# Altium schematic sheet Revision History.SchDoc: Revision History
size 431 x 279 mm; DrawnBy: DD; DocumentNumber: GHL-1-21002; Revision: C; SheetNumber: 7; SheetTotal: 7; ProjectID: 263-03
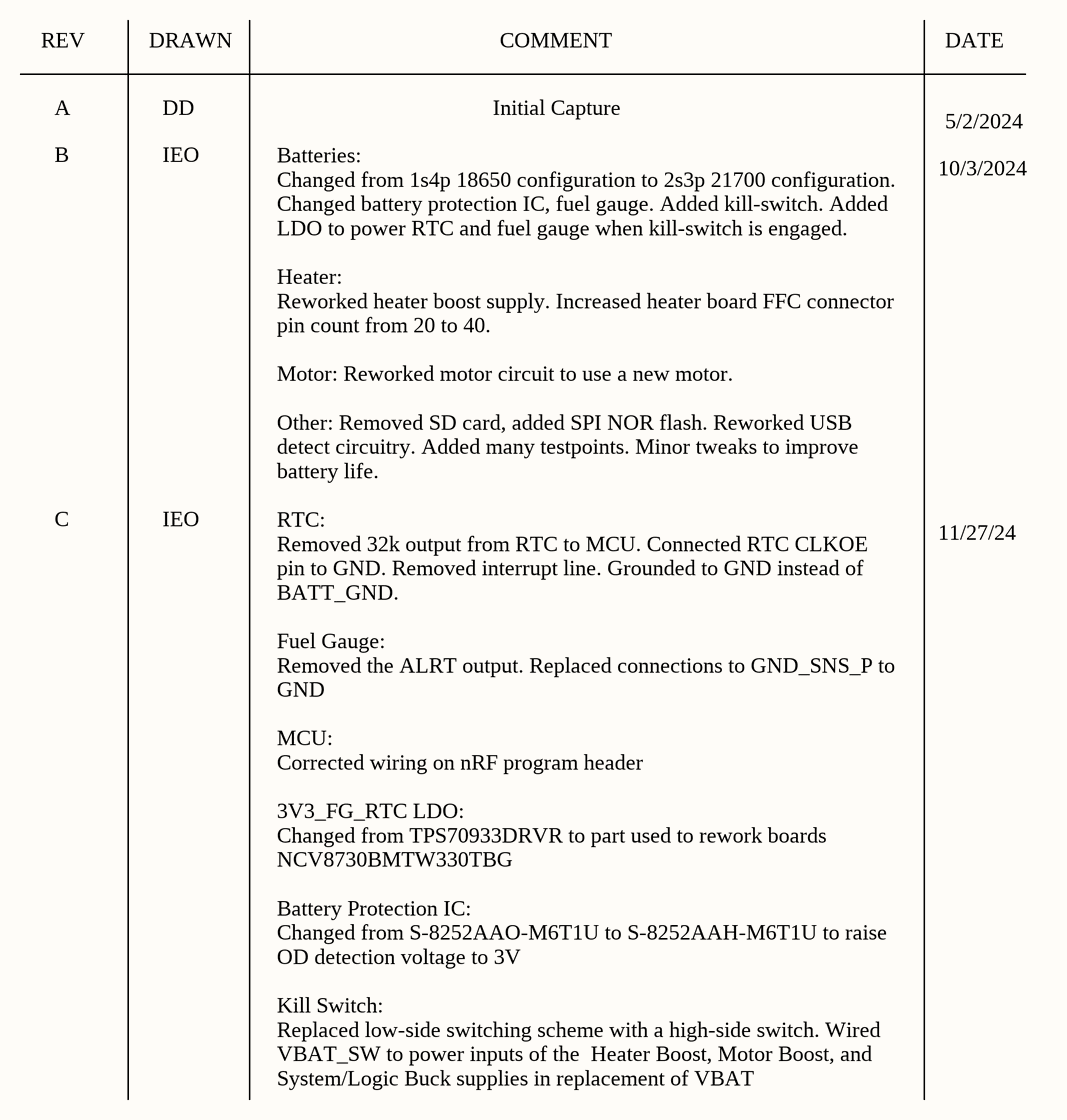
[diagram p0: Revision History.SchDoc]

## Notes on the sheet
- REV
- DRAWN
- COMMENT
- DATE
- A
- B
- DD
- IEO
- Initial Capture
- 10/3/2024
- 5/2/2024
- Batteries:
  Changed from 1s4p 18650 configuration to 2s3p 21700 configuration. Changed battery protection IC, fuel gauge. Added kill-switch. Added LDO to power RTC and fuel gauge when kill-switch is engaged.
  Heater:
  Reworked heater boost supply. Increased heater board FFC connector pin count from 20 to 40.
  Motor: Reworked motor circuit to use a new motor.
  Other: Removed SD card, added SPI NOR flash. Reworked USB detect circuitry. Added many testpoints. Minor tweaks to improve battery life.
- C
- 11/27/24
- RTC:
  Removed 32k output from RTC to MCU. Connected RTC CLKOE pin to GND. Removed interrupt line. Grounded to GND instead of BATT_GND.
  Fuel Gauge:
  Removed the ALRT output. Replaced connections to GND_SNS_P to GND
  MCU:
  Corrected wiring on nRF program header
  3V3_FG_RTC LDO:
  Changed from TPS70933DRVR to part used to rework boards NCV8730BMTW330TBG
  Battery Protection IC:
  Changed from S-8252AAO-M6T1U to S-8252AAH-M6T1U to raise OD detection voltage to 3V
  Kill Switch:
  Replaced low-side switching scheme with a high-side switch. Wired VBAT_SW to power inputs of the  Heater Boost, Motor Boost, and System/Logic Buck supplies in replacement of VBAT
- REVISION
- DESCRIPTION
- APPROVED
- 295 Foster St
- PROJECT
- www.odic.com <http://www.odic.com>
- Littleton, MA
- 01460
- Suite 202
- TITLE
- DRAWN:
- CHECKED:
- APPROVALS
- SIZE
- PROJECT ID
- DWG NO.
- SHEET
- OF
- APPROVED:
- FILE NAME